# EAGLE schematic schema_v4_0 (EAGLE 6.4)
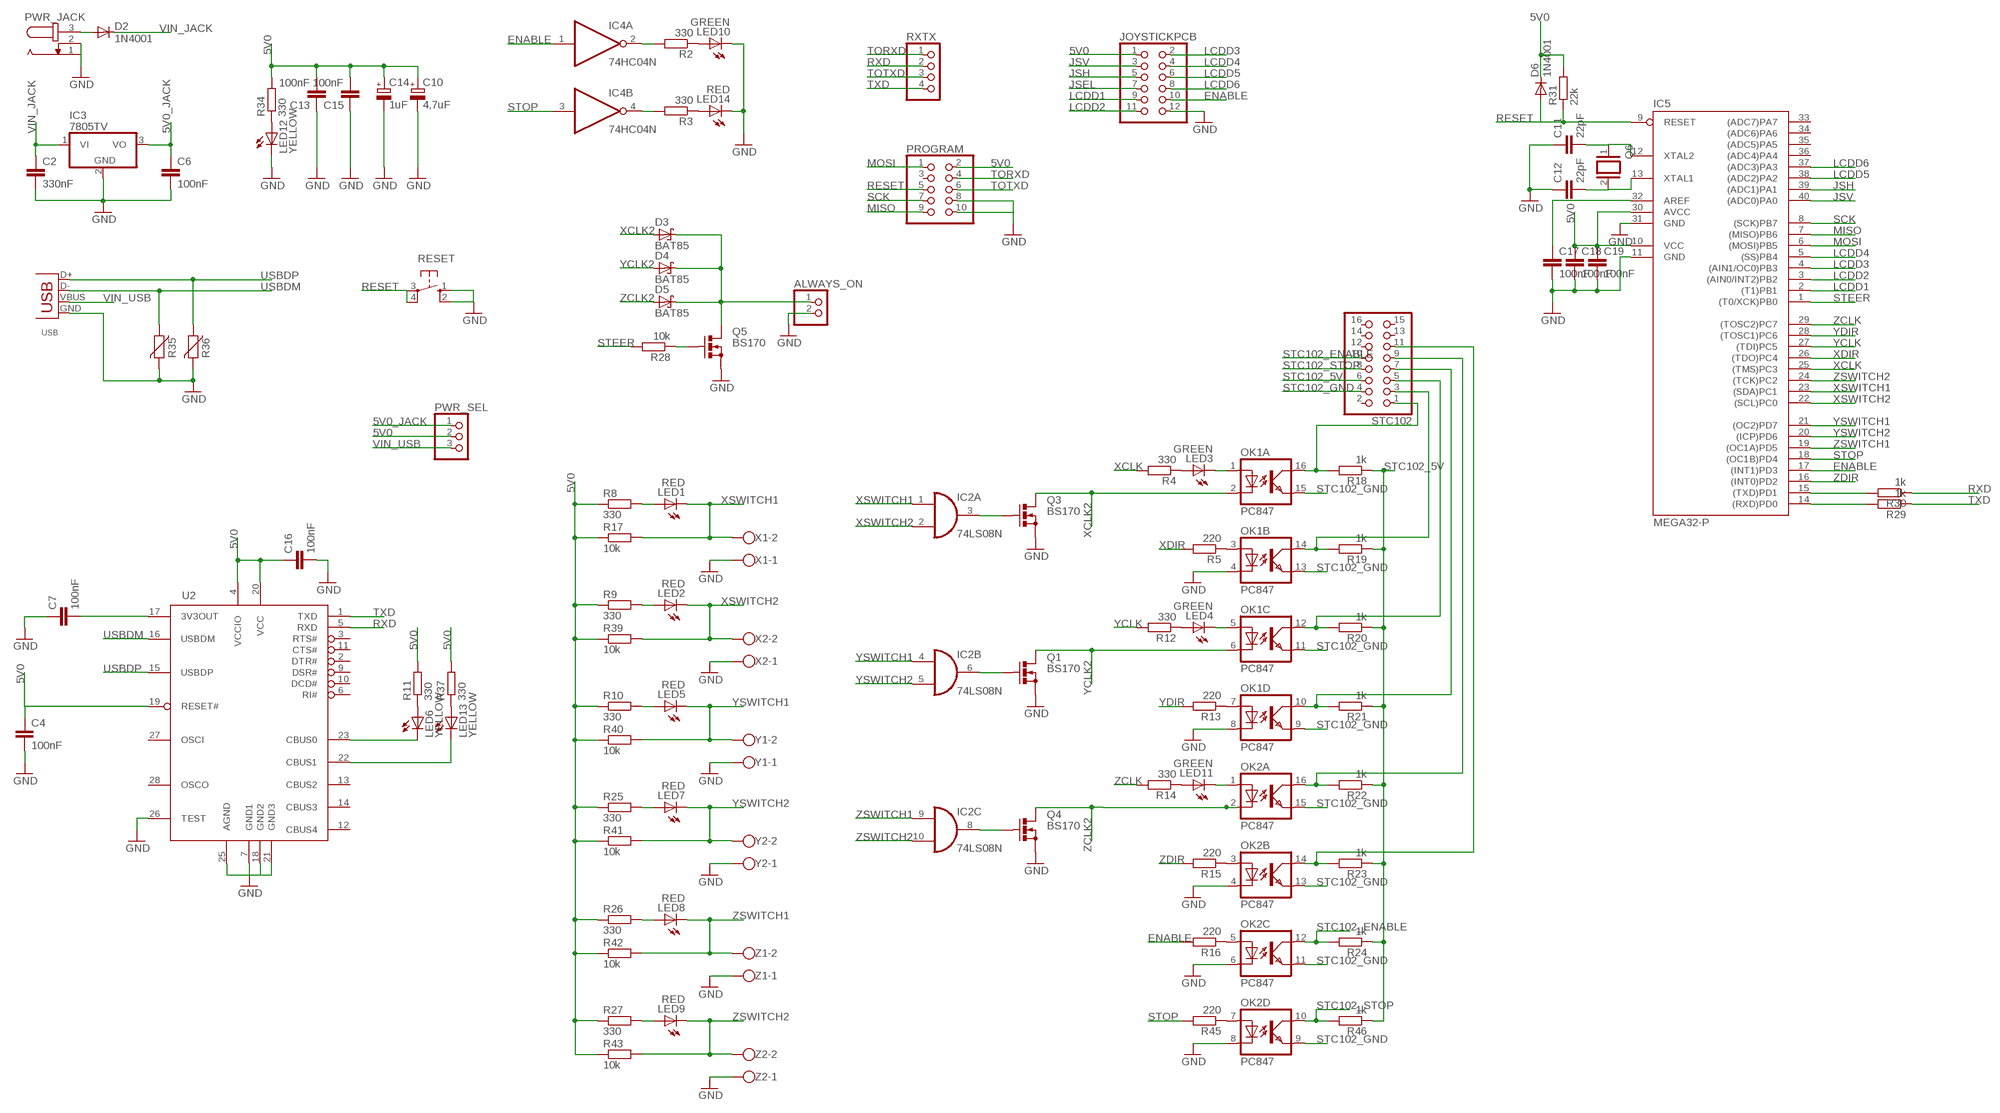
[diagram p0: schematic, sheet 1]

## Parts
ALWAYS_ON  PINHD-1X2  [1X02]
C2  330nF  C-EU025-025X050  [C025-025X050]
C4  100nF  C-EUC0805K  [C0805K]
C6  100nF  C-EU025-025X050  [C025-025X050]
C7  100nF  C-EUC0805K  [C0805K]
C10  4,7uF  CPOL-EUE2.5-5  [E2,5-5]
C11  22pF  C-EUC0805K  [C0805K]
C12  22pF  C-EUC0805K  [C0805K]
C13  100nF  C-EU025-025X050  [C025-025X050]
C14  1uF  CPOL-EUE2.5-5  [E2,5-5]
C15  100nF  C-EU025-025X050  [C025-025X050]
C16  100nF  C-EUC0805K  [C0805K]
C17  100nF  C-EUC0805K  [C0805K]
C18  100nF  C-EUC0805K  [C0805K]
C19  100nF  C-EUC0805K  [C0805K]
D2  1N4001  1N4004  [DO41-10]
D3  BAT85  BAT42  [DO35-10]
D4  BAT85  BAT42  [DO35-10]
D5  BAT85  BAT42  [DO35-10]
D6  1N4001  1N4004  [DO41-10]
IC2  74LS08N  [DIL14]
IC3  7805TV  [TO220V]
IC4  74HC04N  [DIL14]
IC5  MEGA32-P  [DIL40]
JOYSTICKPCB  PINHD-2X6  [2X06]
LED1  RED  LED3MM  [LED3MM]
LED2  RED  LED3MM  [LED3MM]
LED3  GREEN  LED3MM  [LED3MM]
LED4  GREEN  LED3MM  [LED3MM]
LED5  RED  LED3MM  [LED3MM]
LED6  YELLOW  LED3MM  [LED3MM]
LED7  RED  LED3MM  [LED3MM]
LED8  RED  LED3MM  [LED3MM]
LED9  RED  LED3MM  [LED3MM]
LED10  GREEN  LED3MM  [LED3MM]
LED11  GREEN  LED3MM  [LED3MM]
LED12  YELLOW  LED3MM  [LED3MM]
LED13  YELLOW  LED3MM  [LED3MM]
LED14  RED  LED3MM  [LED3MM]
OK1  PC847  [DIL16]
OK2  PC847  [DIL16]
PROGRAM  PINHD-2X5  [2X05]
PWR_JACK  JACK-PLUG0  [SPC4077]
PWR_SEL  PINHD-1X3  [1X03]
Q1  BS170  [SOT54E]
Q3  BS170  [SOT54E]
Q4  BS170  [SOT54E]
Q5  BS170  [SOT54E]
Q6  XTAL/S  [QS]
R2  330  R-EU_0207/10  [0207/10]
R3  330  R-EU_0207/10  [0207/10]
R4  330  R-EU_0207/10  [0207/10]
R5  220  R-EU_0207/10  [0207/10]
R8  330  R-EU_R0805  [R0805]
R9  330  R-EU_R0805  [R0805]
R10  330  R-EU_R0805  [R0805]
R11  330  R-EU_R0805  [R0805]
R12  330  R-EU_0207/10  [0207/10]
R13  220  R-EU_0207/10  [0207/10]
R14  330  R-EU_0207/10  [0207/10]
R15  220  R-EU_0207/10  [0207/10]
R16  220  R-EU_0207/10  [0207/10]
R17  10k  R-EU_0207/10  [0207/10]
R18  1k  R-EU_0207/10  [0207/10]
R19  1k  R-EU_0207/10  [0207/10]
R20  1k  R-EU_0207/10  [0207/10]
R21  1k  R-EU_0207/10  [0207/10]
R22  1k  R-EU_0207/10  [0207/10]
R23  1k  R-EU_0207/10  [0207/10]
R24  1k  R-EU_0207/10  [0207/10]
R25  330  R-EU_R0805  [R0805]
R26  330  R-EU_R0805  [R0805]
R27  330  R-EU_R0805  [R0805]
R28  10k  R-EU_0207/10  [0207/10]
R29  1k  R-EU_R0805  [R0805]
R30  1k  R-EU_R0805  [R0805]
R31  22k  R-EU_0207/10  [0207/10]
R34  330  R-EU_0207/10  [0207/10]
R35  VARISTORCN0603  [CT/CN0603]
R36  VARISTORCN0603  [CT/CN0603]
R37  330  R-EU_R0805  [R0805]
R39  10k  R-EU_0207/10  [0207/10]
R40  10k  R-EU_0207/10  [0207/10]
R41  10k  R-EU_0207/10  [0207/10]
R42  10k  R-EU_0207/10  [0207/10]
R43  10k  R-EU_0207/10  [0207/10]
R45  220  R-EU_0207/10  [0207/10]
R46  1k  R-EU_0207/10  [0207/10]
RESET  10-XX  [B3F-10XX]
RXTX  PINHD-1X4  [1X04]
STC102  PINHD-2X8  [2X08]
U2  FT232RL  [SSOP28DB]
USB  USB-B-H  [USB-B-H]
X1  W237-102  [W237-102]
X2  W237-102  [W237-102]
Y1  W237-102  [W237-102]
Y2  W237-102  [W237-102]
Z1  W237-102  [W237-102]
Z2  W237-102  [W237-102]

## Nets
5V0: C4.1 C10.+ C13.2 C14.+ C15.2 C16.1 C18.1 C19.1 D6.C IC5.10(VCC) IC5.30(AVCC) JOYSTICKPCB.1 PROGRAM.2 PWR_SEL.2 R8.1 R9.1 R10.1 R11.2 R17.1 R25.1 R26.1 R27.1 R31.2 R34.2 R37.2 R39.1 R40.1 R41.1 R42.1 R43.1 U2.4(VCCIO) U2.19(RESET#) U2.20(VCC)
5V0_JACK: C6.1 IC3.3(VO) PWR_SEL.1
ENABLE: IC4.1(A:I) IC5.17((INT1)PD3) JOYSTICKPCB.10 R16.2
GND: ALWAYS_ON.2 C2.2 C4.2 C6.2 C7.1 C10.- C11.1 C12.1 C13.1 C14.- C15.1 C16.2 C17.2 C18.2 C19.2 IC3.2(GND) IC5.11(GND) IC5.31(GND) JOYSTICKPCB.12 LED10.K(C) LED12.K(C) LED14.K(C) OK1.4(B:C) OK1.8(D:C) OK2.4(B:C) OK2.6(C:C) OK2.8(D:C) PROGRAM.8 PWR_JACK.1 PWR_JACK.2 Q1.S Q3.S Q4.S Q5.S R35.2 R36.2 RESET.1(S) RESET.2(S1) U2.7(GND1) U2.18(GND2) U2.21(GND3) U2.25(AGND) U2.26(TEST) USB.GND X1.1 X2.1 Y1.1 Y2.1 Z1.1 Z2.1
JSEL: JOYSTICKPCB.7
JSH: IC5.39((ADC1)PA1) JOYSTICKPCB.5
JSV: IC5.40((ADC0)PA0) JOYSTICKPCB.3
LCDD1: IC5.2((T1)PB1) JOYSTICKPCB.9
LCDD2: IC5.3((AIN0/INT2)PB2) JOYSTICKPCB.11
LCDD3: IC5.4((AIN1/OC0)PB3) JOYSTICKPCB.2
LCDD4: IC5.5((SS)PB4) JOYSTICKPCB.4
LCDD5: IC5.38((ADC2)PA2) JOYSTICKPCB.6
LCDD6: IC5.37((ADC3)PA3) JOYSTICKPCB.8
MISO: IC5.7((MISO)PB6) PROGRAM.9
MOSI: IC5.6((MOSI)PB5) PROGRAM.1
N$1: LED3.A R4.1
N$2: LED1.A R8.2
N$4: OK2.7(D:A) R45.1
N$5: ALWAYS_ON.1 D3.C D4.C D5.C Q5.D
N$6: LED4.A R12.1
N$7: LED11.A R14.1
N$8: D2.A PWR_JACK.3
N$9: OK1.16(A:COL) R18.2 STC102.1
N$10: OK2.5(C:A) R16.1
N$11: OK1.14(B:COL) R19.2 STC102.3
N$12: OK1.12(C:COL) R20.2 STC102.5
N$13: OK1.10(D:COL) R21.2 STC102.7
N$14: OK2.16(A:COL) R22.2 STC102.9
N$15: OK2.14(B:COL) R23.2 STC102.11
N$16: LED2.A R9.2
N$17: LED6.K(C) U2.23(CBUS0)
N$18: LED13.K(C) U2.22(CBUS1)
N$19: LED6.A R11.1
N$20: LED10.A R2.1
N$21: IC2.3(A:O) Q3.G
N$22: LED14.A R3.1
N$23: LED5.A R10.2
N$24: LED7.A R25.2
N$27: LED8.A R26.2
N$28: LED9.A R27.2
N$30: OK1.3(B:A) R5.1
N$31: LED4.K(C) OK1.5(C:A)
N$32: OK1.7(D:A) R13.1
N$33: LED3.K(C) OK1.1(A:A)
N$34: OK2.3(B:A) R15.1
N$36: Q5.G R28.1
N$37: IC5.14((RXD)PD0) R29.2
N$38: IC2.8(C:O) Q4.G
N$39: IC2.6(B:O) Q1.G
N$40: LED11.K(C) OK2.1(A:A)
N$42: IC4.2(A:O) R2.2
N$43: IC4.4(B:O) R3.2
N$44: IC5.15((TXD)PD1) R30.2
N$45: C11.2 IC5.12(XTAL2) Q6.1
N$46: C12.2 IC5.13(XTAL1) Q6.2
N$47: C17.1 IC5.32(AREF)
N$51: LED12.A R34.1
N$55: LED13.A R37.1
N$59: PROGRAM.10
N$96: C7.2 U2.17(3V3OUT)
RESET: D6.A IC5.9(RESET) PROGRAM.5 R31.1 RESET.3(P) RESET.4(P1)
RXD: R30.1 RXTX.2 U2.5(RXD)
SCK: IC5.8((SCK)PB7) PROGRAM.7
STC102_5V: R18.1 R19.1 R20.1 R21.1 R22.1 R23.1 R24.1 R46.1 STC102.6
STC102_ENABLE: OK2.12(C:COL) R24.2 STC102.10
STC102_GND: OK1.9(D:EMIT) OK1.11(C:EMIT) OK1.13(B:EMIT) OK1.15(A:EMIT) OK2.9(D:EMIT) OK2.11(C:EMIT) OK2.13(B:EMIT) OK2.15(A:EMIT) STC102.4
STC102_STOP: OK2.10(D:COL) R46.2 STC102.8
STEER: IC5.1((T0/XCK)PB0) R28.2
STOP: IC4.3(B:I) IC5.18((OC1B)PD4) R45.2
TORXD: PROGRAM.4 RXTX.1
TOTXD: PROGRAM.6 RXTX.3
TXD: R29.1 RXTX.4 U2.1(TXD)
USBDM: R35.1 U2.16(USBDM) USB.D-
USBDP: R36.1 U2.15(USBDP) USB.D+
VIN_JACK: C2.1 D2.C IC3.1(VI)
VIN_USB: PWR_SEL.3 USB.VBUS
XCLK: IC5.25((TMS)PC3) R4.2
XCLK2: D3.A OK1.2(A:C) Q3.D
XDIR: IC5.26((TDO)PC4) R5.2
XSWITCH1: IC2.1(A:I0) IC5.23((SDA)PC1) LED1.K(C) R17.2 X1.2
XSWITCH2: IC2.2(A:I1) IC5.22((SCL)PC0) LED2.K(C) R39.2 X2.2
YCLK: IC5.27((TDI)PC5) R12.2
YCLK2: D4.A OK1.6(C:C) Q1.D
YDIR: IC5.28((TOSC1)PC6) R13.2
YSWITCH1: IC2.4(B:I0) IC5.21((OC2)PD7) LED5.K(C) R40.2 Y1.2
YSWITCH2: IC2.5(B:I1) IC5.20((ICP)PD6) LED7.K(C) R41.2 Y2.2
ZCLK: IC5.29((TOSC2)PC7) R14.2
ZCLK2: D5.A OK2.2(A:C) Q4.D
ZDIR: IC5.16((INT0)PD2) R15.2
ZSWITCH1: IC2.9(C:I0) IC5.19((OC1A)PD5) LED8.K(C) R42.2 Z1.2
ZSWITCH2: IC2.10(C:I1) IC5.24((TCK)PC2) LED9.K(C) R43.2 Z2.2
Unconnected: IC2.11(D:O) IC2.12(D:I0) IC2.13(D:I1) IC4.5(C:I) IC4.6(C:O) IC4.8(D:O) IC4.9(D:I) IC4.10(E:O) IC4.11(E:I) IC4.12(F:O) IC4.13(F:I) IC5.33((ADC7)PA7) IC5.34((ADC6)PA6) IC5.35((ADC5)PA5) IC5.36((ADC4)PA4) PROGRAM.3 STC102.2 STC102.12 STC102.13 STC102.14 STC102.15 STC102.16 U2.2(DTR#) U2.3(RTS#) U2.6(RI#) U2.9(DSR#) U2.10(DCD#) U2.11(CTS#) U2.12(CBUS4) U2.13(CBUS2) U2.14(CBUS3) U2.27(OSCI) U2.28(OSCO)

## Power pins joined to a net without a drawn wire
GND: IC2.7(P:GND) IC4.7(P:GND)
VCC: IC2.14(P:VCC) IC4.14(P:VCC)

## Library data of the parts
ALWAYS_ON = pinhead:PINHD-1X2: PIN HEADER
C2 C4 C6 C7 C11-C13 C15-C19 = rcl:C-EU: CAPACITOR, European symbol
C10 C14 = rcl:CPOL-EU: POLARIZED CAPACITOR, European symbol
D2 D6 = diode:1N4004: DIODE general purpose rectifier, 1 A
D3-D5 = diode:BAT42: DIODE barrier diode
IC2 = 74xx-eu:74*08: Quad 2-input AND gate
IC3 = linear:78*: Positive VOLTAGE REGULATOR Source: http://cache.national.com/ds/LM/LM78L05.pdf http://www.fairchildsemi.com/ds/LM/LM7805.pdf
IC4 = 74xx-eu:74*04: Hex INVERTER
IC5 = atmel:MEGA32-P: MICROCONTROLLER 32 Kbytes FLASH 2 Kbytes SRAM 1 Kbytes EEPROM USART 8-channel 10 bit ADC Source: www.atmel.com .. doc2503.pdf; MPN: ATMEGA32-16PU; OC_FARNELL: 1661729; OC_NEWARK: 51P1794
JOYSTICKPCB = pinhead:PINHD-2X6: PIN HEADER
LED1-LED14 = led:LED: LED OSRAM: - CHIPLED LG R971, LG N971, LY N971, LG Q971, LY Q971, LO R971, LY R971 LH N974, LH R974 LS Q976, LO Q976, LY Q976 LO Q996 - Hyper CHIPLED LW Q18S LB Q993, LB Q99A, LB R99A - SideLED LS A670, LO A670, LY A670, LG A670, LP A670 LB A673, LV A673, LT A673, LW A673 LH A674 LY A675 LS A676, LA A676, LO A676, LY A676, LW A676 LS A679, LY A679, LG A679 - Hyper Micro SIDELED® LS Y876, LA Y876, LO Y876, LY Y876 LT Y87S - SmartLED LW L88C, LW L88S LB L89C, LB L89S, LG L890 LS L89K, LO L89K, LY L89K LS L896, LA L896, LO L896, LY L896 - TOPLED LS T670, LO T670, LY T670, LG T670, LP T670 LSG T670, LSP T670, LSY T670, LOP T670, LYG T670 LG T671, LOG T671, LSG T671 LB T673, LV T673, LT T673, LW T673 LH T674 LS T676, LA T676, LO T676, LY T676, LB T676, LH T676, LSB T676, LW T676 LB T67C, LV T67C, LT T67C, LS T67K, LO T67K, LY T67K, LW E67C LS E67B, LA E67B, LO E67B, LY E67B, LB E67C, LV E67C, LT E67C LW T67C LS T679, LY T679, LG T679 LS T770, LO T770, LY T770, LG T770, LP T770 LB T773, LV T773, LT T773, LW T773 LH T774 LS E675, LA E675, LY E675, LS T675 LS T776, LA T776, LO T776, LY T776, LB T776 LHGB T686 LT T68C, LB T68C - Hyper Mini TOPLED® LB M676 - Mini TOPLED Santana® LG M470 LS M47K, LO M47K, LY M47K Source: http://www.osram.convergy.de LUXEON: - LUMILED® LXK2-PW12-R00, LXK2-PW12-S00, LXK2-PW14-U00, LXK2-PW14-V00 LXK2-PM12-R00, LXK2-PM12-S00, LXK2-PM14-U00 LXK2-PE12-Q00, LXK2-PE12-R00, LXK2-PE12-S00, LXK2-PE14-T00, LXK2-PE14-U00 LXK2-PB12-K00, LXK2-PB12-L00, LXK2-PB12-M00, LXK2-PB14-N00, LXK2-PB14-P00, LXK2-PB14-Q00 LXK2-PR12-L00, LXK2-PR12-M00, LXK2-PR14-Q00, LXK2-PR14-R00 LXK2-PD12-Q00, LXK2-PD12-R00, LXK2-PD12-S00 LXK2-PH12-R00, LXK2-PH12-S00 LXK2-PL12-P00, LXK2-PL12-Q00, LXK2-PL12-R00 Source: www.luxeon.com KINGBRIGHT: KA-3528ASYC Source: www.kingbright.com
OK1 OK2 = optocoupler:PC847: SHARP OPTO COUPLER; OC_FARNELL: 9707735; OC_NEWARK: unknown
PROGRAM = pinhead:PINHD-2X5: PIN HEADER
PWR_JACK = con-jack:JACK-PLUG: DC POWER JACK Power Jack, DC, Right Angle, Through Hole, Rated 5A at 16VDC, PC Terminals Distributor: Farnell (www.Farnell.de) Drawing: 84N1161.pdf / 84N1162.pdf Manufacturer: SPC Technology (www.spctechnology.com) Type: SPC4077 / SPC 4078; OC_FARNELL: unknown; OC_NEWARK: unknown
PWR_SEL = pinhead:PINHD-1X3: PIN HEADER
Q1 Q3-Q5 = transistor-small-signal:BS170: N-CHANNEL MOS FET
Q6 = special:XTAL/S: CRYSTAL
R2-R5 R8-R31 R34 R37 R39-R43 R45 R46 = rcl:R-EU_: RESISTOR, European symbol
R35 R36 = varistor:VARISTOR: VARISTOR
RESET = switch-omron:10-XX: OMRON SWITCH; MPN: B3F-1000; OC_FARNELL: 176432; OC_NEWARK: 36M3542
RXTX = pinhead:PINHD-1X4: PIN HEADER
STC102 = pinhead:PINHD-2X8: PIN HEADER
U2 = ftdichip-5:FT232RL: USB UART 4th Generation USB UART (USB <-> Serial) Controller
USB = con-usb-3:USB: USB Connectors
X1 X2 Y1 Y2 Z1 Z2 = con-wago-500:W237-102: WAGO SCREW CLAMP; MPN: 237-102; OC_FARNELL: unknown; OC_NEWARK: 70K9898

## Net classes
0 default: width 0.203 mm